# Altium schematic sheet CPU.SchDoc
size A4
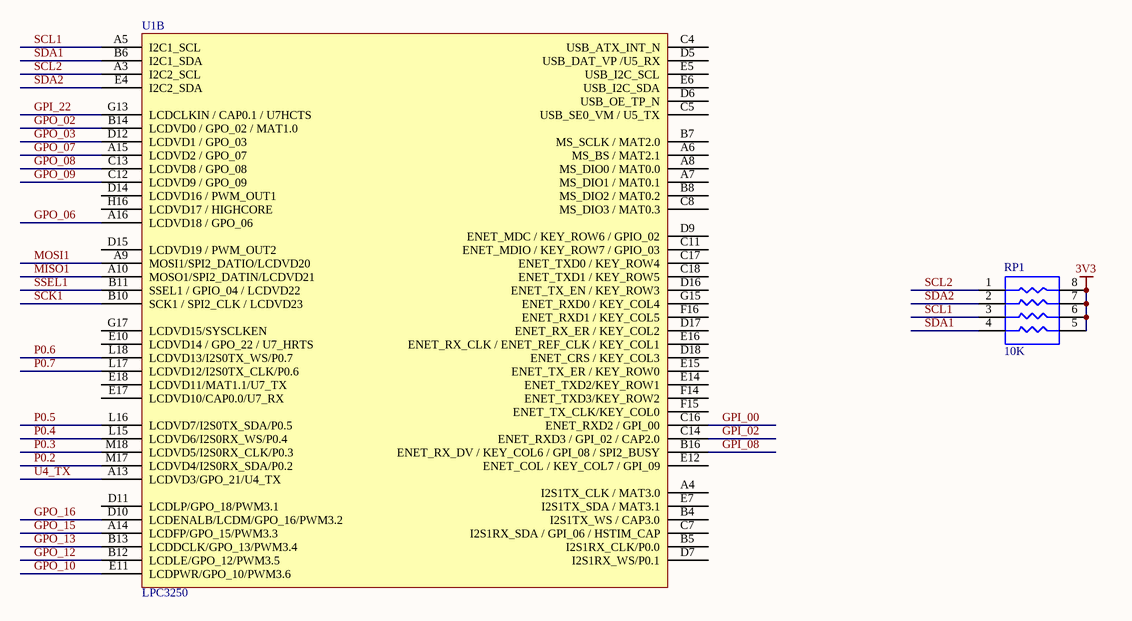
[diagram p0: CPU.SchDoc]

## Parts
RP1  10K  [PZ-4-0.8B]
U1  LPC3250  [TFBGA296]  (part B of 4)

## Nets
3V3: RP1.5 RP1.6 RP1.7 RP1.8
GPI_00: U1.C16(ENET_RXD2_/_GPI_00)
GPI_02: U1.C14(ENET_RXD3_/_GPI_02_/_CAP2.0)
GPI_08: U1.B16(ENET_RX_DV_/_KEY_COL6_/_GPI_08_/_SPI2_BUSY)
GPI_22: U1.G13(LCDCLKIN_/_CAP0.1_/_U7HCTS)
GPO_02: U1.B14(LCDVD0_/_GPO_02_/_MAT1.0)
GPO_03: U1.D12(LCDVD1_/_GPO_03)
GPO_06: U1.A16(LCDVD18_/_GPO_06)
GPO_07: U1.A15(LCDVD2_/_GPO_07)
GPO_08: U1.C13(LCDVD8_/_GPO_08)
GPO_09: U1.C12(LCDVD9_/_GPO_09)
GPO_10: U1.E11(LCDPWR/GPO_10/PWM3.6)
GPO_12: U1.B12(LCDLE/GPO_12/PWM3.5)
GPO_13: U1.B13(LCDDCLK/GPO_13/PWM3.4)
GPO_15: U1.A14(LCDFP/GPO_15/PWM3.3)
GPO_16: U1.D10(LCDENALB/LCDM/GPO_16/PWM3.2)
MISO1: U1.A10(MOSO1/SPI2_DATIN/LCDVD21)
MOSI1: U1.A9(MOSI1/SPI2_DATIO/LCDVD20)
P0.2: U1.M17(LCDVD4/I2S0RX_SDA/P0.2)
P0.3: U1.M18(LCDVD5/I2S0RX_CLK/P0.3)
P0.4: U1.L15(LCDVD6/I2S0RX_WS/P0.4)
P0.5: U1.L16(LCDVD7/I2S0TX_SDA/P0.5)
P0.6: U1.L18(LCDVD13/I2S0TX_WS/P0.7)
P0.7: U1.L17(LCDVD12/I2S0TX_CLK/P0.6)
SCK1: U1.B10(SCK1_/_SPI2_CLK_/_LCDVD23)
SCL1: RP1.3 U1.A5(I2C1_SCL)
SCL2: RP1.1 U1.A3(I2C2_SCL)
SDA1: RP1.4 U1.B6(I2C1_SDA)
SDA2: RP1.2 U1.E4(I2C2_SDA)
SSEL1: U1.B11(SSEL1_/_GPIO_04_/_LCDVD22)
U4_TX: U1.A13(LCDVD3/GPO_21/U4_TX)

Not connected (* = marked no-connect by the designer): U1 A4(I2S1TX_CLK_/_MAT3.0) A6(MS_BS_/_MAT2.1) A7(MS_DIO1_/_MAT0.1) A8(MS_DIO0_/_MAT0.0) B4(I2S1TX_WS_/_CAP3.0) B5(I2S1RX_CLK/P0.0) B7(MS_SCLK_/_MAT2.0) B8(MS_DIO2_/_MAT0.2) C4(USB_ATX_INT_N) C5(USB_SE0_VM_/_U5_TX) C7(I2S1RX_SDA_/_GPI_06_/_HSTIM_CAP) C8(MS_DIO3_/_MAT0.3) C11(ENET_MDIO_/_KEY_ROW7_/_GPIO_03) C17(ENET_TXD0_/_KEY_ROW4) C18(ENET_TXD1_/_KEY_ROW5) D5(USB_DAT_VP_/U5_RX) D6(USB_OE_TP_N) D7(I2S1RX_WS/P0.1) D9(ENET_MDC_/_KEY_ROW6_/_GPIO_02) D11(LCDLP/GPO_18/PWM3.1) D14(LCDVD16_/_PWM_OUT1) D15(LCDVD19_/_PWM_OUT2) D16(ENET_TX_EN_/_KEY_ROW3) D17(ENET_RX_ER_/_KEY_COL2) D18(ENET_CRS_/_KEY_COL3) E5(USB_I2C_SCL) E6(USB_I2C_SDA) E7(I2S1TX_SDA_/_MAT3.1) E10(LCDVD14_/_GPO_22_/_U7_HRTS) E12(ENET_COL_/_KEY_COL7_/_GPI_09) E14(ENET_TXD2/KEY_ROW1) E15(ENET_TX_ER_/_KEY_ROW0) E16(ENET_RX_CLK_/_ENET_REF_CLK_/_KEY_COL1) E17(LCDVD10/CAP0.0/U7_RX) E18(LCDVD11/MAT1.1/U7_TX) F14(ENET_TXD3/KEY_ROW2) F15(ENET_TX_CLK/KEY_COL0) F16(ENET_RXD1_/_KEY_COL5) G15(ENET_RXD0_/_KEY_COL4) G17(LCDVD15/SYSCLKEN) H16(LCDVD17_/_HIGHCORE)

## Library data of the parts
RP1 = RP